# EAGLE design FSWSJE2IZ6BVKJ2 (EAGLE 9.5.2)
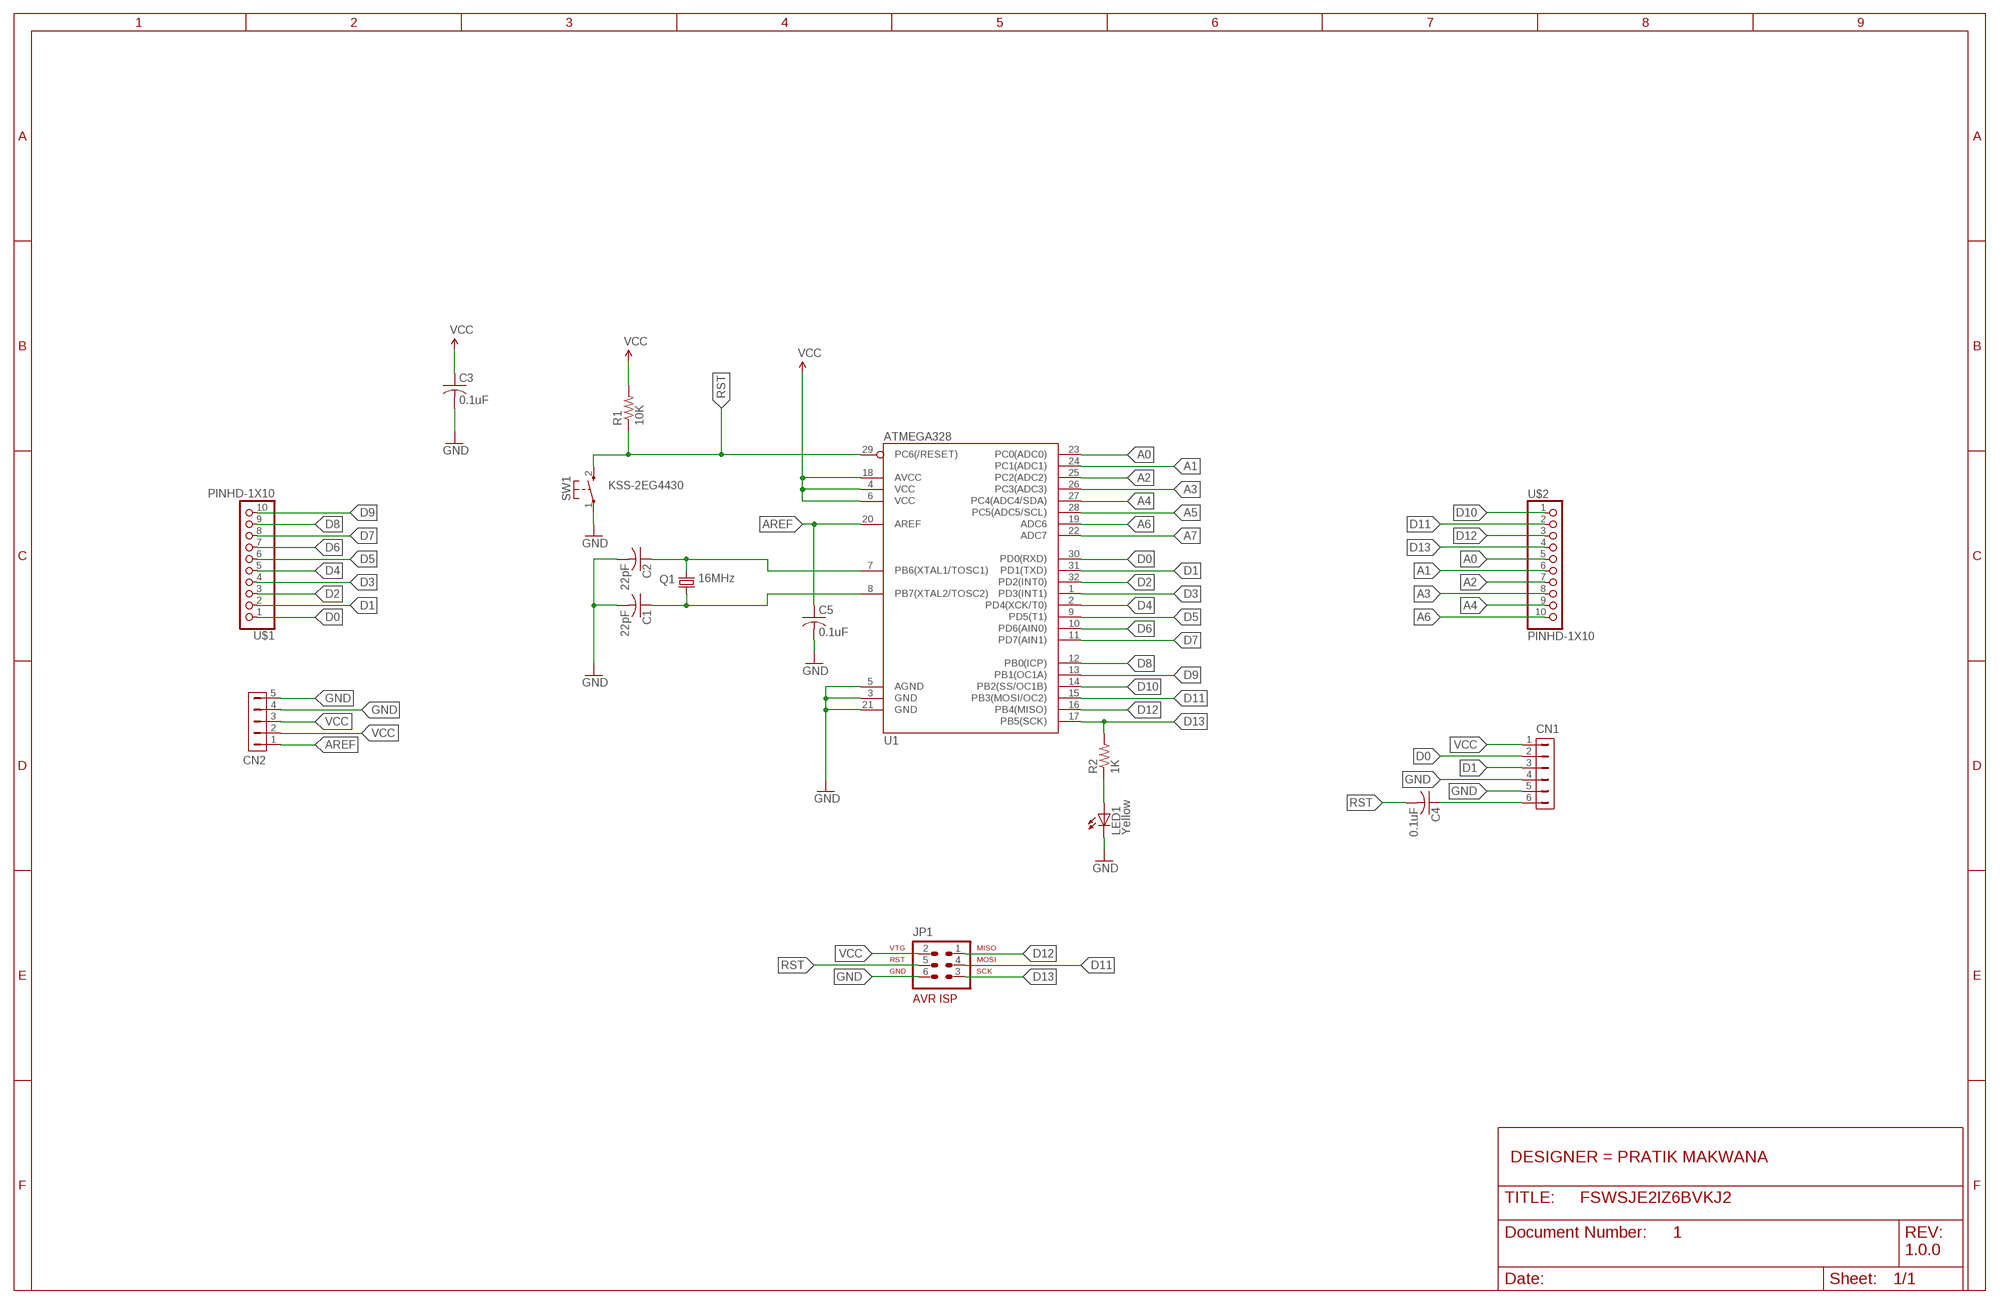
[diagram p0: schematic, sheet 1]
FRAME1 (FRAME_B_L): DESIGNER: PRATIK MAKWANA; DOC: 1; REV: 1.0.0

## Parts
C1  22pF  C-USC1206  [C1206]
C2  22pF  C-USC1206  [C1206]
C3  0.1uF  C-USC0805  [C0805]
C4  0.1uF  C-USC0805  [C0805]
C5  0.1uF  C-USC0805  [C0805]
CN1  HDR-1X6-SIP-100  [SIP-100-6V]
CN2  HDR-1X5-SIP-100  [SIP-100-5V]
JP1  AVR-ISP-6  [AVR-ISP-6]
LED1  Yellow  LEDCHIP-LED0805  [CHIP-LED0805]
Q1  16MHz  CRYTALHC49S  [HC49/S]
R1  10K  R-US_R1206  [R1206]
R2  1K  R-US_R1206  [R1206]
SW1  KSS-2EG4430  [KSS-2EG4430]
U1  ATMEGA328  [TQFP32-08]
U$1  PINHD-1X10  [1X10-BIG]
U$2  PINHD-1X10  [1X10-BIG]

## Nets
A0: U1.23(PC0(ADC0)) U$2.5
A1: U1.24(PC1(ADC1)) U$2.6
A2: U1.25(PC2(ADC2)) U$2.7
A3: U1.26(PC3(ADC3)) U$2.8
A4: U1.27(PC4(ADC4/SDA)) U$2.9
A5: U1.28(PC5(ADC5/SCL))
A6: U1.19(ADC6) U$2.10
A7: U1.22(ADC7)
AREF: C5.1 CN2.1 U1.20(AREF)
D0: CN1.2 U1.30(PD0(RXD)) U$1.1
D1: CN1.3 U1.31(PD1(TXD)) U$1.2
D2: U1.32(PD2(INT0)) U$1.3
D3: U1.1(PD3(INT1)) U$1.4
D4: U1.2(PD4(XCK/T0)) U$1.5
D5: U1.9(PD5(T1)) U$1.6
D6: U1.10(PD6(AIN0)) U$1.7
D7: U1.11(PD7(AIN1)) U$1.8
D8: U1.12(PB0(ICP)) U$1.9
D9: U1.13(PB1(OC1A)) U$1.10
D10: U1.14(PB2(SS/OC1B)) U$2.1
D11: JP1.4 U1.15(PB3(MOSI/OC2)) U$2.2
D12: JP1.1 U1.16(PB4(MISO)) U$2.3
D13: JP1.3 R2.2 U1.17(PB5(SCK)) U$2.4
GND: C1.2 C2.2 C3.2 C5.2 CN1.4 CN1.5 CN2.4 CN2.5 JP1.6 LED1.C SW1.1(P) U1.3(GND) U1.5(AGND) U1.21(GND)
N$6: C4.1 CN1.6
N$43: C2.1 Q1.2 U1.7(PB6(XTAL1/TOSC1))
N$44: C1.1 Q1.1 U1.8(PB7(XTAL2/TOSC2))
N$50: LED1.A R2.1
RST: C4.2 JP1.5 R1.1 SW1.2(S) U1.29(PC6(/RESET))
VCC: C3.1 CN1.1 CN2.2 CN2.3 JP1.2 R1.2 U1.4(VCC) U1.6(VCC) U1.18(AVCC)

## Library data of the parts
C1-C5 = adafruit:C-US: CAPACITOR, American symbol
CN1 = con-hdrs40:HDR-1X6: HEADER CONNECTOR
CN2 = con-hdrs40:HDR-1X5: HEADER CONNECTOR
JP1 = atmel-1:AVR-ISP-6: AVR ISP-6 Serial Programming Header
LED1 = adafruit:LED: LED OSRAM: - CHIPLED LG R971, LG N971, LY N971, LG Q971, LY Q971, LO R971, LY R971 LH N974, LH R974 LS Q976, LO Q976, LY Q976 LO Q996 - Hyper CHIPLED LW Q18S LB Q993, LB Q99A, LB R99A - SideLED LS A670, LO A670, LY A670, LG A670, LP A670 LB A673, LV A673, LT A673, LW A673 LH A674 LY A675 LS A676, LA A676, LO A676, LY A676, LW A676 LS A679, LY A679, LG A679 - Hyper Micro SIDELED® LS Y876, LA Y876, LO Y876, LY Y876 LT Y87S - SmartLED LW L88C, LW L88S LB L89C, LB L89S, LG L890 LS L89K, LO L89K, LY L89K LS L896, LA L896, LO L896, LY L896 - TOPLED LS T670, LO T670, LY T670, LG T670, LP T670 LSG T670, LSP T670, LSY T670, LOP T670, LYG T670 LG T671, LOG T671, LSG T671 LB T673, LV T673, LT T673, LW T673 LH T674 LS T676, LA T676, LO T676, LY T676, LB T676, LH T676, LSB T676, LW T676 LB T67C, LV T67C, LT T67C, LS T67K, LO T67K, LY T67K, LW E67C LS E67B, LA E67B, LO E67B, LY E67B, LB E67C, LV E67C, LT E67C LW T67C LS T679, LY T679, LG T679 LS T770, LO T770, LY T770, LG T770, LP T770 LB T773, LV T773, LT T773, LW T773 LH T774 LS E675, LA E675, LY E675, LS T675 LS T776, LA T776, LO T776, LY T776, LB T776 LHGB T686 LT T68C, LB T68C - Hyper Mini TOPLED® LB M676 - Mini TOPLED Santana® LG M470 LS M47K, LO M47K, LY M47K Source: http://www.osram.convergy.de/
Q1 = crystal:CRYTAL: CRYSTAL
R1 R2 = adafruit:R-US_: RESISTOR, American symbol
SW1 = buttons:KSS-2EG4430: Size: 3x6mm Height: 5mm from PCB Rating: DC12v 50mA Travel: 0.25±0.10mm Operating Force: 180±50gf Return Force: 60gf min Contact resistance: 100m? max Insulation resistance: 100M? min Operating life?50,000 cycles
U1 = thecustomgeek:ATMEGA328: ATmega328P-AU TQFP 32 pin
U$1 U$2 = adafruit:PINHD-1X10: Pin header 1x10 0.1" spacing With round pins

## Board
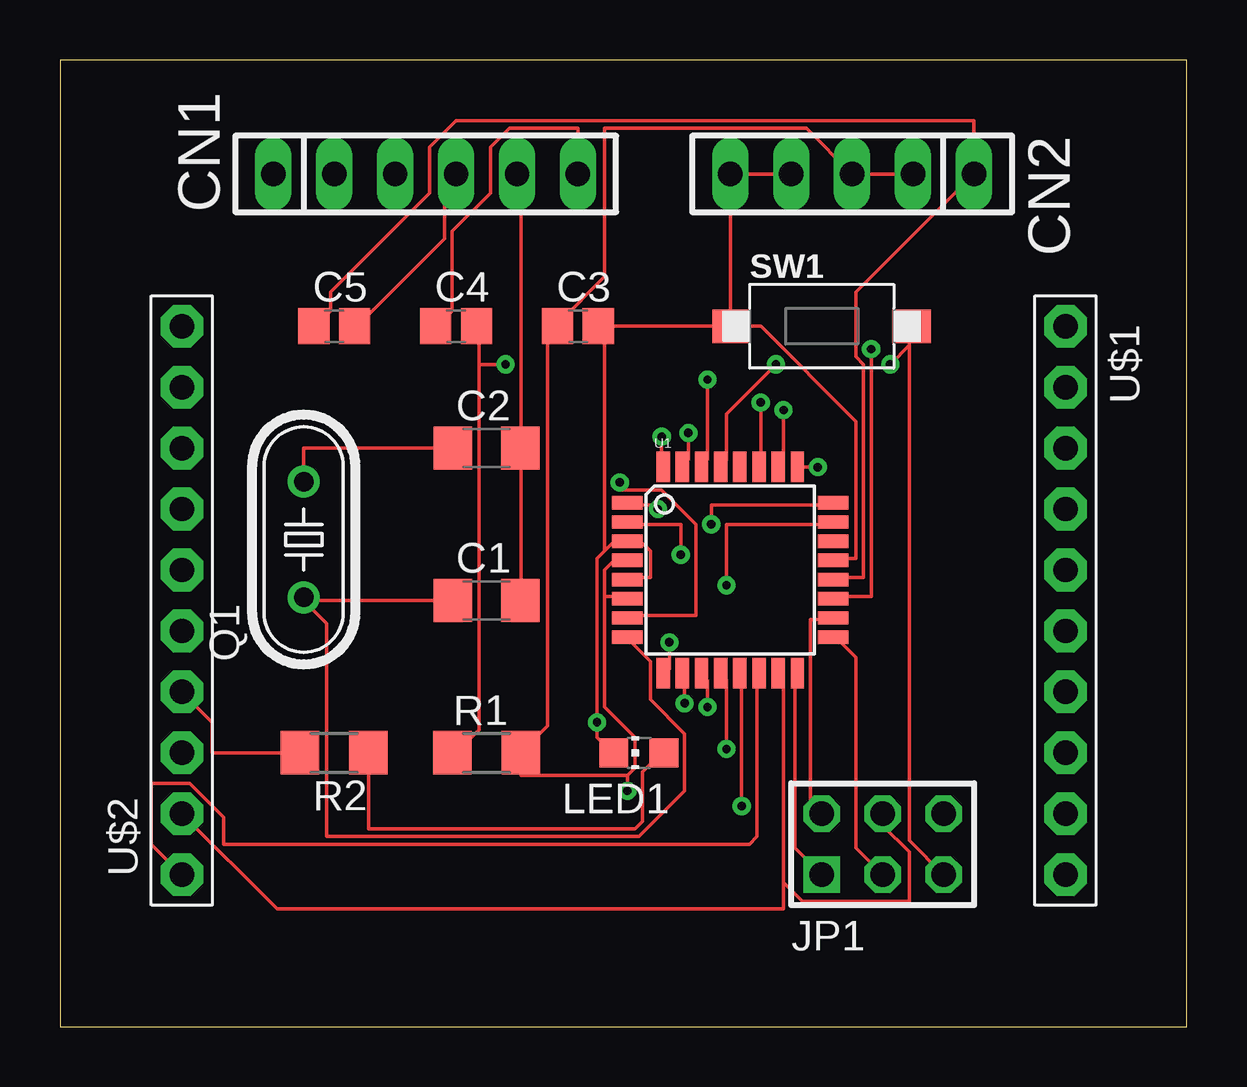
[diagram p1: board, top side]
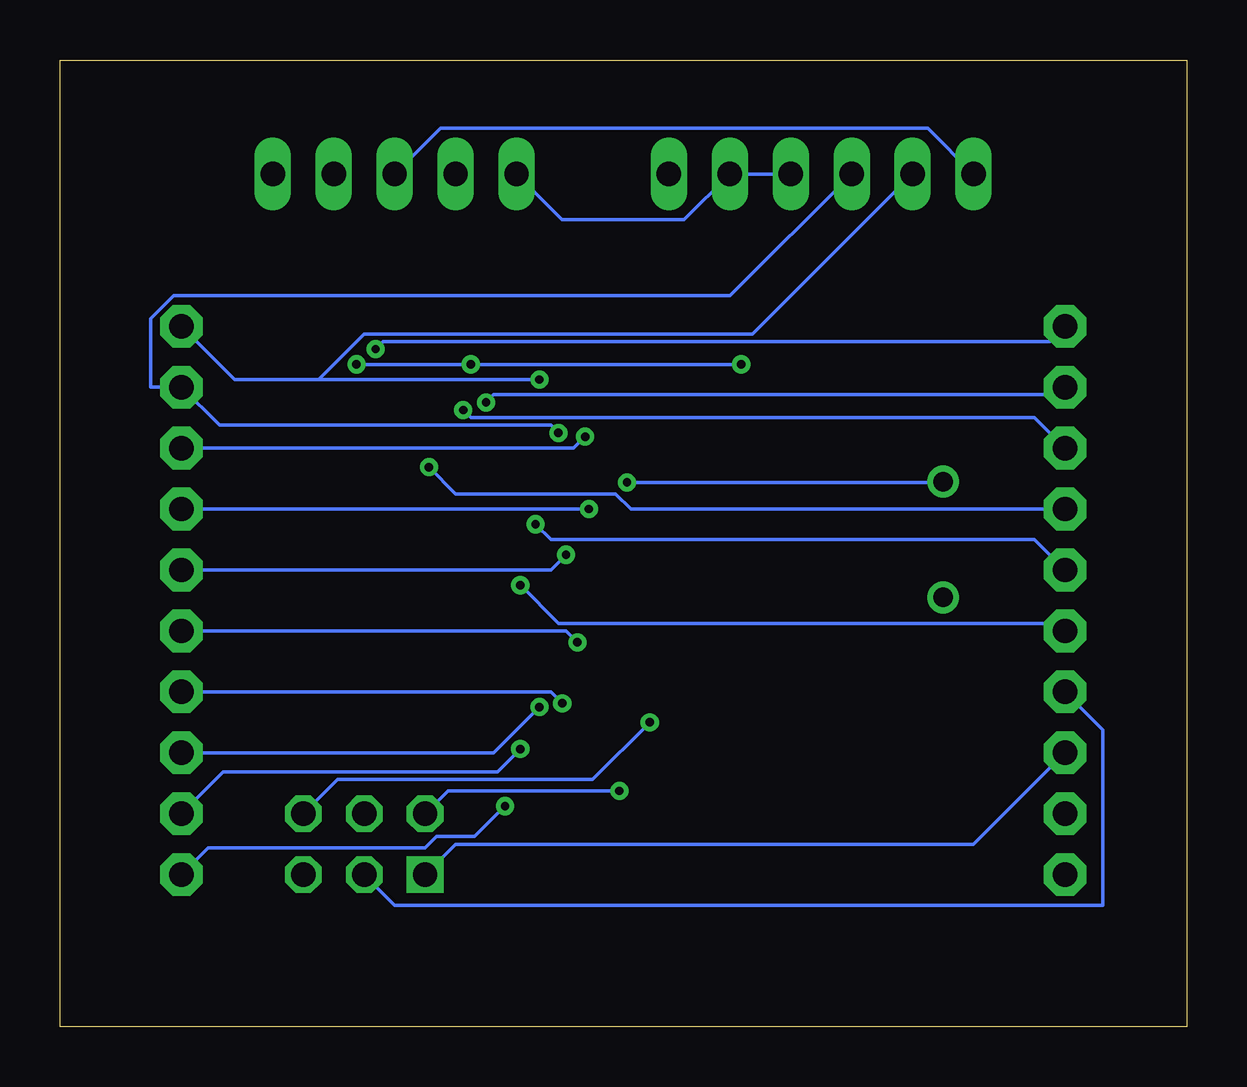
[diagram p2: board, bottom side, seen from below]

Size 46.97 x 40.31 mm. Coordinates in mm from the lower left corner, seen from the top.
Outline: 0,0 46.97,0 46.97,40.31 0,40.31 0,0
Copper layers (1*16): Top 0.035mm / dielectric 1.5mm / Bottom 0.035mm
Design rules "default": minimum track width 6mil, minimum drill 0.35mm, track to track 6mil, track to pad 6mil, pad to pad 6mil, via to via 6mil, smd to smd 6mil, copper to edge 40mil, drill to drill 6mil, minimum pad ring 10mil, minimum via ring 8mil, stop-mask expansion 4mil, vias tented up to drill 0mil, thermal gap 10mil

### Footprints (pad centres in the part's own frame; a part is rotated, then mirrored left to right if it is on the bottom)
C1206 = smd 1.6 x 1.8: 1 -1.4,0; 2 1.4,0
C0805 = smd 1.3 x 1.5: 1 -0.85,0; 2 0.85,0
SIP-100-6V = drill 1.016 long: 1 -6.35,0; 2 -3.81,0; 3 -1.27,0; 4 1.27,0; 5 3.81,0; 6 6.35,0
SIP-100-5V = drill 1.016 long: 1 -5.08,0; 2 -2.54,0; 3 0,0; 4 2.54,0; 5 5.08,0
AVR-ISP-6 = drill 1.016 square: 1 -2.54,-1.27 | drill 1.016 octagon: 2 -2.54,1.27; 3 0,-1.27; 4 0,1.27; 5 2.54,-1.27; 6 2.54,1.27
CHIP-LED0805 = smd 1.2 x 1.2: A 0,-1.05; C 0,1.05
HC49/S = drill 0.813: 1 -2.413,0; 2 2.413,0
R1206 = smd 1.6 x 1.803: 1 -1.422,0; 2 1.422,0
KSS-2EG4430 = smd 1.6 x 1.4: 1 -3.75,0; 2 3.75,0
TQFP32-08 = smd 1.27 x 0.559: 1 -4.293,2.8; 2 -4.293,2; 3 -4.293,1.2; 4 -4.293,0.4; 5 -4.293,-0.4; 6 -4.293,-1.2; 7 -4.293,-2; 8 -4.293,-2.8; 17 4.293,-2.8; 18 4.293,-2; 19 4.293,-1.2; 20 4.293,-0.4; 21 4.293,0.4; 22 4.293,1.2; 23 4.293,2; 24 4.293,2.8 | smd 0.559 x 1.27: 9 -2.8,-4.293; 10 -2,-4.293; 11 -1.2,-4.293; 12 -0.4,-4.293; 13 0.4,-4.293; 14 1.2,-4.293; 15 2,-4.293; 16 2.8,-4.293; 25 2.8,4.293; 26 2,4.293; 27 1.2,4.293; 28 0.4,4.293; 29 -0.4,4.293; 30 -1.2,4.293; 31 -2,4.293; 32 -2.8,4.293
1X10-BIG = drill 1.016 pad 1.778 octagon: 1 -11.43,0; 2 -8.89,0; 3 -6.35,0; 4 -3.81,0; 5 -1.27,0; 6 1.27,0; 7 3.81,0; 8 6.35,0; 9 8.89,0; 10 11.43,0

### Placement (x,y rotation side)
C1  17.78,17.78 0 top
C2  17.78,24.13 0 top
C3  21.59,29.21 0 top
C4  16.51,29.21 0 top
C5  11.43,29.21 0 top
CN1  15.24,35.56 0 top
CN2  33.02,35.56 180 top
JP1  34.29,7.62 0 top
LED1  24.13,11.43 90 top
Q1  10.16,20.32 90 top
R1  17.78,11.43 0 top
R2  11.43,11.43 180 top
SW1  31.75,29.21 0 top
U1  27.94,19.05 0 top
U$1  41.91,17.78 270 top
U$2  5.08,17.78 90 top

### Tracks (layer width: path | path; a pad name or v marks a point on that pad's centre or on a via)
A0  (via drill 0.35)
  Top 0.152: v27.78,18.41 27.78,20.95 32.23,20.95 U1.23
  Bottom 0.152: v27.78,18.41 26.19,16.83 5.4,16.83 U$2.5
A1  (via drill 0.35)
  Top 0.152: v27.15,20.95 27.15,21.75 32.23,21.75 U1.24
  Bottom 0.152: v27.15,20.95 26.51,20.32 6.35,20.32 U$2.6
A2  (via drill 0.35)
  Top 0.152: v31.59,23.34 30.8,23.34 U1.25
  Bottom 0.152: v31.59,23.34 30.48,22.23 23.81,22.23 23.18,21.59 U$2.7
A3  (via drill 0.35)
  Top 0.152: v30.16,25.72 30.16,23.65 30,23.5 U1.26
  Bottom 0.152: v30.16,25.72 29.84,25.4 6.35,25.4 U$2.8
A4  (via drill 0.35)
  Top 0.152: v29.21,26.04 29.21,23.5 U1.27
  Bottom 0.152: v29.21,26.04 28.89,26.35 5.4,26.35 U$2.9
A6  (via drill 0.35)
  Top 0.152: v33.81,28.26 33.81,17.94 32.38,17.94 U1.19
  Bottom 0.152: v33.81,28.26 33.5,28.57 5.71,28.57 U$2.10
AREF
  Top 0.152: U1.20 32.38,18.73 33.5,18.73 33.5,27.62 33.18,27.94 33.18,30.64 CN2.1 38.1,37.78 16.51,37.78 15.4,36.67 15.4,34.77 11.27,30.64 11.27,29.84 10.64,29.21 C5.1
D0  (via drill 0.35)
  Top 0.152: v26.99,26.99 26.99,23.65 26.83,23.5 U1.30
  Bottom 0.152: 36.2,26.99 39.69,26.99 U$1.1 | 36.2,26.99 v26.99,26.99 | CN1.2 18.1,28.89 34.29,28.89 36.2,26.99
D1  (via drill 0.35)
  Top 0.152: v26.19,24.77 26.19,23.65 26.04,23.5 U1.31
  Bottom 0.152: v26.19,24.77 26.51,25.08 40.32,25.08 U$1.2 43.18,26.67 43.18,29.53 42.23,30.48 19.05,30.48 CN1.3
D2  (via drill 0.35)
  Top 0.152: v25.08,24.61 25.08,23.5 U1.32
  Bottom 0.152: v25.08,24.61 25.56,24.13 U$1.3
D3  (via drill 0.35)
  Top 0.152: v24.92,21.59 24.92,21.75 23.65,21.75 U1.1
  Bottom 0.152: U$1.4 v24.92,21.59
D4  (via drill 0.35)
  Top 0.152: v25.88,19.68 25.88,20.95 23.65,20.95 U1.2
  Bottom 0.152: v25.88,19.68 26.51,19.05 U$1.5
D5  (via drill 0.35)
  Top 0.152: v25.4,16.03 25.4,14.92 25.24,14.76 U1.9
  Bottom 0.152: v25.4,16.03 25.88,16.51 U$1.6
D6  (via drill 0.35)
  Top 0.152: v26.04,13.49 26.04,14.61 U1.10
  Bottom 0.152: v26.04,13.49 26.51,13.97 U$1.7
D7  (via drill 0.35)
  Top 0.152: v26.99,13.34 26.99,14.45 26.83,14.61 U1.11
  Bottom 0.152: v26.99,13.34 28.89,11.43 U$1.8
D8  (via drill 0.35)
  Top 0.152: v27.78,11.59 27.78,14.45 27.62,14.61 U1.12
  Bottom 0.152: v27.78,11.59 28.73,10.64 40.16,10.64 U$1.9
D9  (via drill 0.35)
  Top 0.152: v28.42,9.21 28.42,14.61 U1.13
  Bottom 0.152: v28.42,9.21 29.69,7.94 31.27,7.94 31.75,7.46 40.8,7.46 U$1.10
D10
  Top 0.152: U$2.1 3.81,7.62 3.81,10.16 5.4,10.16 6.83,8.73 6.83,7.62 28.73,7.62 29.05,7.94 29.05,14.61 U1.14
D11
  Top 0.152: 30.16,6.03 30.16,14.45 30,14.61 U1.15 | 30.16,6.03 30.96,5.24 35.4,5.24 35.4,7.3 34.29,8.41 JP1.4 | U$2.2 9.05,4.92 30.16,4.92 30.16,6.03
D12
  Top 0.152: JP1.1 30.64,7.46 30.64,14.61 U1.16
  Bottom 0.152: U$2.3 8.89,7.62 30.48,7.62 JP1.1
D13
  Top 0.152: R2.2 6.35,11.43 6.35,12.7 U$2.4 | JP1.3 33.18,7.46 33.18,15.4 32.38,16.19 U1.17
  Bottom 0.152: U$2.4 3.49,12.38 3.49,5.08 33.02,5.08 JP1.3
GND  (via drill 0.35)
  Top 0.152: 19.21,24.13 19.21,17.78 C1.2 | CN1.4 16.03,35.08 16.03,32.86 12.38,29.21 C5.2 | 19.21,24.13 19.21,35.4 CN1.5 | 19.21,24.13 C2.2 | CN2.4 CN2.5 27.94,29.21 | U1.21 32.38,19.53 33.18,19.53 33.18,25.24 29.21,29.21 SW1.1 27.94,29.21 | 27.94,29.21 22.7,29.21 | 22.7,29.21 C3.2 22.54,29.21 | 22.7,19.84 23.02,20.16 23.5,20.16 U1.3 23.65,20.16 24.29,20.16 24.61,19.84 24.61,18.73 23.65,18.73 U1.5 | 22.7,19.84 22.38,19.53 v22.38,12.7 22.38,12.06 23.02,11.43 LED1.C | 22.7,19.84 22.7,29.21
  Bottom 0.152: CN1.4 CN1.5 20.95,33.66 26.04,33.66 CN2.5 | JP1.6 35.4,10.32 24.77,10.32 v22.38,12.7
N$6
  Top 0.152: CN1.6 21.59,37.47 18.73,37.47 17.94,36.67 17.94,34.77 16.35,33.18 16.35,29.84 15.72,29.21 C4.1
N$43  (via drill 0.35)
  Top 0.152: v23.34,22.7 23.34,22.38 25.08,22.38 26.51,20.95 26.51,17.14 23.65,17.14 U1.7 | C2.1 10.16,24.13 Q1.2
  Bottom 0.152: v23.34,22.7 10.16,22.7 Q1.2
N$44
  Top 0.152: 10.16,17.78 11.11,16.83 11.11,7.94 24.13,7.94 26.04,9.84 26.04,12.22 24.61,13.65 24.61,15.24 23.65,16.19 U1.8 | 10.16,17.78 C1.1 | 10.16,17.78 Q1.1
N$50
  Top 0.152: LED1.A 25.08,11.43 24.29,10.64 24.29,8.57 23.97,8.26 12.86,8.26 R2.1
RST  (via drill 0.35)
  Top 0.152: 17.46,27.62 17.46,12.38 16.51,11.43 R1.1 | 17.46,27.62 17.46,29.21 C4.2 | v29.84,27.62 27.78,25.56 27.78,23.65 27.62,23.5 U1.29 | 35.4,28.42 v34.61,27.62 | 35.4,28.42 35.4,29.21 SW1.2 | JP1.5 35.4,7.78 35.4,28.42 | v18.57,27.62 17.46,27.62
  Bottom 0.152: v34.61,27.62 v29.84,27.62 v18.57,27.62
VCC  (via drill 0.35)
  Top 0.152: CN2.2 CN2.3 31.11,37.47 22.7,37.47 22.7,31.27 20.8,29.37 20.8,29.21 C3.1 20.64,29.21 20.32,28.89 20.32,12.54 R1.2 | JP1.2 31.27,9.37 31.27,16.99 32.23,16.99 U1.18 | 22.7,17.94 23.5,17.94 U1.6 | 22.7,17.94 22.7,19.05 23.02,19.37 23.5,19.37 U1.4 | 22.7,17.94 22.7,13.34 23.97,12.06 23.97,10.79 23.65,10.48 | 23.65,10.48 19.21,10.48 R1.2 | R1.2 | 23.65,10.48 v23.65,9.84
  Bottom 0.152: CN1.1 10.79,37.47 31.11,37.47 CN2.3 | JP1.2 30.8,9.84 v23.65,9.84